# Altium schematic sheet Sheet1.SchDoc
size A4; SheetNumber: 1; SheetTotal: 1
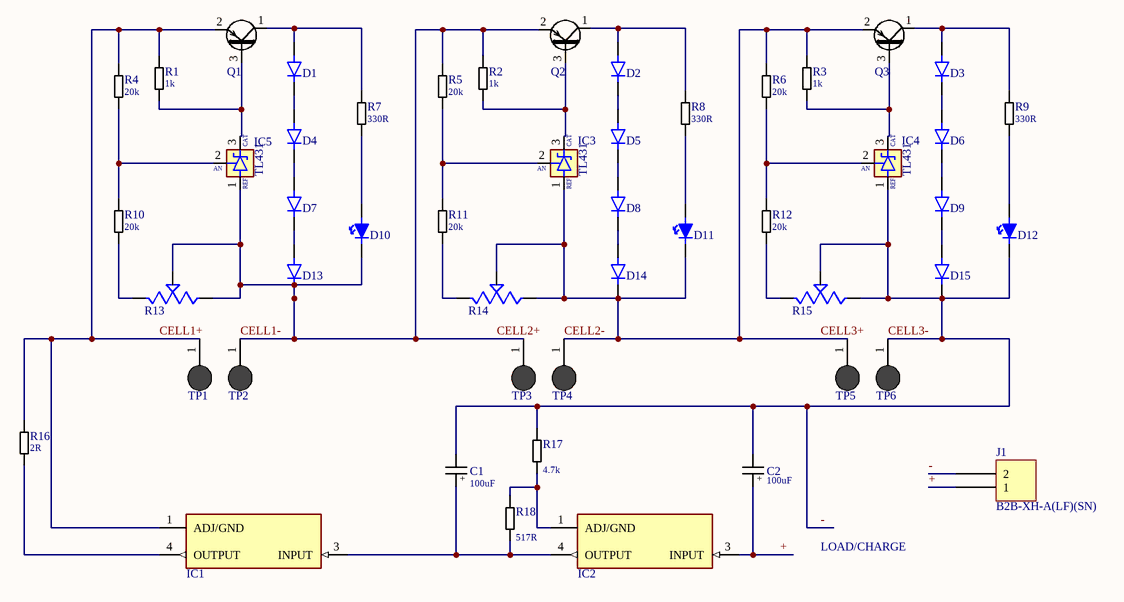
[diagram p0: Sheet1.SchDoc]

## Parts
C1  Capacitance: 100uF  [AL_ELEC_CAP_RAD]  (hidden comment: 493-15610-ND)
C2  Capacitance: 100uF  [AL_ELEC_CAP_RAD]  (hidden comment: 493-15610-ND)
D1  1N4007 SMD  [DO-214AC]  (value not drawn)
D2  1N4007 SMD  [DO-214AC]  (value not drawn)
D3  1N4007 SMD  [DO-214AC]  (value not drawn)
D4  1N4007 SMD  [DO-214AC]  (value not drawn)
D5  1N4007 SMD  [DO-214AC]  (value not drawn)
D6  1N4007 SMD  [DO-214AC]  (value not drawn)
D7  1N4007 SMD  [DO-214AC]  (value not drawn)
D8  1N4007 SMD  [DO-214AC]  (value not drawn)
D9  1N4007 SMD  [DO-214AC]  (value not drawn)
D10  LED TH  [TH_LED]  (value not drawn)
D11  LED TH  [TH_LED]  (value not drawn)
D12  LED TH  [TH_LED]  (value not drawn)
D13  1N4007 SMD  [DO-214AC]  (value not drawn)
D14  1N4007 SMD  [DO-214AC]  (value not drawn)
D15  1N4007 SMD  [DO-214AC]  (value not drawn)
IC1  497-1574-2-ND  [TO-252-3]  (value not drawn)
IC2  497-1574-2-ND  [TO-252-3]  (value not drawn)
IC3  TL431  [TO92-3]
IC4  TL431  [TO92-3]
IC5  TL431  [TO92-3]
J1  B2B-XH-A(LF)(SN)  [JST XH B2B-XH-A]
Q1  BD140  [TO126 (SOT32)]  (value not drawn)
Q2  BD140  [TO126 (SOT32)]  (value not drawn)
Q3  BD140  [TO126 (SOT32)]  (value not drawn)
R1  Resistance: 1k  [TH_RES]  (hidden comment: RES 1K OHM TH)
R2  Resistance: 1k  [TH_RES]  (hidden comment: RES 1K OHM TH)
R3  Resistance: 1k  [TH_RES]  (hidden comment: RES 1K OHM TH)
R4  Resistance: 20k  [TH_RES]  (hidden comment: RES 20K OHM TH)
R5  Resistance: 20k  [TH_RES]  (hidden comment: RES 20K OHM TH)
R6  Resistance: 20k  [TH_RES]  (hidden comment: RES 20K OHM TH)
R7  Resistance: 330R  [TH_RES]  (hidden comment: RES 330R OHM TH)
R8  Resistance: 330R  [TH_RES]  (hidden comment: RES 330R OHM TH)
R9  Resistance: 330R  [TH_RES]  (hidden comment: RES 330R OHM TH)
R10  Resistance: 20k  [TH_RES]  (hidden comment: RES 20K OHM TH)
R11  Resistance: 20k  [TH_RES]  (hidden comment: RES 20K OHM TH)
R12  Resistance: 20k  [TH_RES]  (hidden comment: RES 20K OHM TH)
R13  TRIMPOT  [Trimpot_tube]  (value not drawn)
R14  TRIMPOT  [Trimpot_tube]  (value not drawn)
R15  TRIMPOT  [Trimpot_tube]  (value not drawn)
R16  Resistance: 2R  [TH_RES]  (hidden comment: RES 2R OHM TH)
R17  Resistance: 4.7k  [TH_RES]  (hidden comment: RES 4.7K OHM TH)
R18  Resistance: 517R  [TH_RES]  (hidden comment: RES 517R OHM TH)
TP1  TEST PAD  [TEST_PAD]  (value not drawn)
TP2  TEST PAD  [TEST_PAD]  (value not drawn)
TP3  TEST PAD  [TEST_PAD]  (value not drawn)
TP4  TEST PAD  [TEST_PAD]  (value not drawn)
TP5  TEST PAD  [TEST_PAD]  (value not drawn)
TP6  TEST PAD  [TEST_PAD]  (value not drawn)

## Nets
+: C2.1 IC2.3(INPUT) J1.1
-: C1.2 C2.2 D12.1 D15.C(K) IC4.1(REF) J1.2 R15.1(CCW) R15.2(WIPER) R17.2 TP6.1  [also labelled CELL3-]
CELL1+: IC1.1(ADJ/GND) Q1.2(C) R1.2 R4.2 R16.2 TP1.1
CELL1-: D10.1 D13.C(K) IC5.1(REF) Q2.2(C) R2.2 R5.2 R13.1(CCW) R13.2(WIPER) TP2.1 TP3.1  [also labelled CELL2+]
CELL2-: D11.1 D14.C(K) IC3.1(REF) Q3.2(C) R3.2 R6.2 R14.1(CCW) R14.2(WIPER) TP4.1 TP5.1  [also labelled CELL3+]
NetC1_1: C1.1 IC1.3(INPUT) IC2.4(OUTPUT) R18.1
NetD1_A: D1.A Q1.1(E) R7.2
NetD1_C: D1.C(K) D4.A
NetD2_A: D2.A Q2.1(E) R8.2
NetD2_C: D2.C(K) D5.A
NetD3_A: D3.A Q3.1(E) R9.2
NetD3_C: D3.C(K) D6.A
NetD4_C: D4.C(K) D7.A
NetD5_C: D5.C(K) D8.A
NetD6_C: D6.C(K) D9.A
NetD7_C: D7.C(K) D13.A
NetD8_C: D8.C(K) D14.A
NetD9_C: D9.C(K) D15.A
NetD10_2: D10.2 R7.1
NetD11_2: D11.2 R8.1
NetD12_2: D12.2 R9.1
NetIC1_4: IC1.4(OUTPUT) R16.1
NetIC2_1: IC2.1(ADJ/GND) R17.1 R18.2
NetIC3_2: IC3.2(ANODE) R5.1 R11.2
NetIC3_3: IC3.3(CATHODE) Q2.3(B) R2.1
NetIC4_2: IC4.2(ANODE) R6.1 R12.2
NetIC4_3: IC4.3(CATHODE) Q3.3(B) R3.1
NetIC5_2: IC5.2(ANODE) R4.1 R10.2
NetIC5_3: IC5.3(CATHODE) Q1.3(B) R1.1
NetR10_1: R10.1 R13.3(CW)
NetR11_1: R11.1 R14.3(CW)
NetR12_1: R12.1 R15.3(CW)

## Notes on the sheet
- LOAD/CHARGE
- (in symbol CAP 100uF Radial TH) +
- (in symbol TL431) CAT; AN

## Library data of the parts
C1 C2 = CAP 100uF Radial TH: Cap Aluminum Lytic 100uF 16V 20% (6.3 X 11mm) Radial 2.5mm 175mA 2000h 105 Bulk; Manufacturer: Nichicon; Manufacturer Part Number: UPJ1C101MED; Impedance: 550mR; Leakage Current: 48uA; Life (Hours): 2000Hour; Dissipation Factor: 0.16%; Lead/Base Style: Straight; Lead Diameter: 0.5mm; Designed by: Semih AŞÇI; Supplier 1: Digi-Key; RoHS: Yes; Category: Aluminum Electrolytic Capacitors; Stock 1: 86; Pricing 1: 1=0,40000, 10=0,27700, 50=0,19360, 100=0,16590, 500=0,12446, 1000=0,10510, 2500=0,09957, 5000=0,09404 (USD); Mount: Through Hole; Case/Package: Radial; Min Operating Temperature: -55°C; Max Operating Temperature: 105°C; Package Quantity: 200; Voltage Rating: 16V; Voltage Rating (DC): 16V; Tolerance: 20%; Ripple Current: 175mA; Packaging: Bulk; Termination: Radial; Series: PJ; Construction: RADIAL; Diameter: 6.3mm; Length: 16mm; Height: 11mm; Lead Pitch: 2.5mm; Height - Seated (Max): 0.472inch; Radiation Hardening: No; Lead Free: Lead Free; RoHS Compliant: Yes; ComponentLink1URL: https://datasheet.ciiva.com/30527/getdatasheetpartid-513226-30527124.pdf?src-supplier=Verical; ComponentLink1Description: https://datasheet.ciiva.com/30527/getdatasheetpartid-513226-30527124.pdf?src-supplier=Verical; ComponentLink2URL: https://datasheet.ciiva.com/109/e-pj-109367.pdf?src-supplier=Digi-Key; ComponentLink2Description: https://datasheet.ciiva.com/109/e-pj-109367.pdf?src-supplier=Digi-Key; ComponentLink3URL: https://datasheet.ciiva.com/11686/e-pj-11686584.pdf?src-supplier=Avnet; ComponentLink3Description: https://datasheet.ciiva.com/11686/e-pj-11686584.pdf?src-supplier=Avnet; ComponentLink4URL: https://datasheet.ciiva.com/16389/e-pj-16389048.pdf?src-supplier=Future+Electronics; ComponentLink4Description: https://datasheet.ciiva.com/16389/e-pj-16389048.pdf?src-supplier=Future+Electronics; Supplier Part Number 1: 493-15610-ND
D1-D9 D13-D15 = 1N4007 SMD: VR=1000V IF=1A 15pF; Manufacturer: ON Semiconductor / Fairchild; Max Surge Current: 30A; Max Reverse Current: 5uA; Forward Voltage: 1.1V; Average Rectified Current: 1A; Max Repetitive Reverse Voltage (Vrrm): 1kV; Element Configuration: Single; Polarity: Standard; Power Dissipation: 3W; Supplier 1: Farnell; Manufacturer Part Number: 1N4007; RoHS: Yes; Category: Rectifier Diodes; Pricing 1: 1=0,17200, 10=0,16000, 100=0,05560, 500=0,04900, 1000=0,03000, 2500=0,01440 (EUR); Case/Package: DO-214AC; Number of Pins: 2; Weight: 0.245g; Contact Plating: Tin,Matte; Min Operating Temperature: -65°C; Max Operating Temperature: 175°C; Packaging: Tape and Reel; Peak Non-Repetitive Surge Current: 30A; Package Quantity: 1000; Max Reverse Voltage (DC): 1kV; Max Forward Surge Current (Ifsm): 30A; Forward Current: 1A; Voltage Rating (DC): 1kV; Current Rating: 1A; Output Current: 1A; Reverse Voltage: 1kV; Series: -; Capacitance: 15pF; Diameter: 2.72mm; Length: 5.2mm; Width: 2.72mm; Height: 5.2mm; Radiation Hardening: No; RoHS Compliant: Yes; Lead Free: Lead Free; Reach SVHC Compliant: No SVHC; ComponentLink1URL: https://datasheet.ciiva.com/1239/1n4005-1239313.pdf?src-supplier=Newark; ComponentLink1Description: https://datasheet.ciiva.com/1239/1n4005-1239313.pdf?src-supplier=Newark; ComponentLink2URL: https://datasheet.ciiva.com/927/1n4001-d-927427.pdf?src-supplier=Digi-Key; ComponentLink2Description: https://datasheet.ciiva.com/927/1n4001-d-927427.pdf?src-supplier=Digi-Key; ComponentLink3URL: https://datasheet.ciiva.com/910/1n4001-910362.pdf?src-supplier=Digi-Key; ComponentLink3Description: https://datasheet.ciiva.com/910/1n4001-910362.pdf?src-supplier=Digi-Key; ComponentLink4URL: https://datasheet.ciiva.com/910/1n4001-910361.pdf?src-supplier=Digi-Key; ComponentLink4Description: https://datasheet.ciiva.com/910/1n4001-910361.pdf?src-supplier=Digi-Key; Supplier Part Number 1: 1467514
D10-D12 = LED TH: Radial red led; Designed by: Semih AŞÇI
IC1 IC2 = LM317: Reg Standard Lin Adj Pos 1.2V to 37V 0.2A 3-Pin (2+Tab) DPAK T/R; Manufacturer: STMicroelectronics; Manufacturer Part Number: LM317MDT-TR; Number of Outputs: 1; Output Current: 500mA; Max Input Voltage: 40V; Min Input Voltage: 4.2V; Max Output Current: 200mA; Polarity: Positive; Reference Voltage: 1.3V; Power Supply Rejection Ratio (PSRR): 80dB; Output Type: Adjustable; Supplier 1: Farnell; RoHS: Yes; Category: Voltage Regulators - Linear; Stock 1: 21391; Pricing 1: 5=1,24000, 10=1,05000, 100=0,80700, 500=0,71400 (EUR); Mount: Surface Mount; Case/Package: TO-252; Number of Pins: 3; Weight: 0.063493oz; Contact Plating: Tin,Matte; Min Operating Temperature: 0°C; Max Operating Temperature: 125°C; Packaging: Tape and Reel; Output Voltage: 37V; Package Quantity: 1; Number of Regulators: 1; Min Output Voltage: 1.2V; Max Output Voltage: 37V; Series: LM317; Length: 6.6mm; Width: 6.2mm; Height: 2.4mm; Radiation Hardening: No; Reach SVHC Compliant: No SVHC; Lead Free: Lead Free; ComponentLink1URL: https://datasheet.ciiva.com/41440/001185006-da-01-en-ic-reg-ldo-adj-lm317mdt-tr-to-252-3-stm-41440182.pdf?src-supplier=Conrad; ComponentLink1Description: https://datasheet.ciiva.com/41440/001185006-da-01-en-ic-reg-ldo-adj-lm317mdt-tr-to-252-3-stm-41440182.pdf?src-supplier=Conrad; Supplier Part Number 1: 2296022
J1 = B2B-XH-A(LF)(SN): CONN HEADER VERT 2POS 2.5MM; Manufacturer: JST Sales America Inc.; Contact Length - Post: 0.134" (3.40mm); Current Rating (Amps): 3A; Material Flammability Rating: UL94 V-0; Number of Positions: 2; Number of Positions Loaded: All; Pitch - Mating: 0.098" (2.50mm); Shrouding: Shrouded - 4 Wall; Style: Board to Cable/Wire; Voltage Rating: 250V; Part Number: B2B-XH-A(LF)(SN); ComponentLink1Description: Datasheet; ComponentLink1URL: http://www.jst-mfg.com/product/pdf/eng/eXH.pdf; ComponentLink2Description: DigiKey Link; ComponentLink2URL: http://digikey.com/product-detail/en/jst-sales-america-inc/B2B-XH-A-LF-SN/455-2247-ND/1651045; Connector Type: Header; Contact Finish - Mating: Tin; Contact Finish - Post: Tin; Contact Material: Brass; Contact Shape: Square; Contact Type: Male Pin; Fastening Type: Detent Lock; Insulation Color: Natural; Insulation Height: 0.276" (7.00mm); Insulation Material: Polyamide (PA66), Nylon 6/6; LastUpdated: 12.01.2020 23:46:08; Lifecycle Status: Active; Minimum Order: 1; Mounting Type: Through Hole; Number of Rows: 1; Operating Temperature: -25°C ~ 85°C; Packaging: Bulk; PartId: 67; Part Status: Active; Price: 0.15; Series: XH; Supplier 1: DigiKey; Supplier Part Number 1: 455-2247-ND; Termination: Press-Fit, Solder
Q1-Q3 = BD140: Trans GP BJT PNP 80V 1.5A 1250mW 3-Pin(3+Tab) SOT-32 Tube / TRANS PNP 80V 1.5A SOT-32; Manufacturer: ON Semiconductor / Fairchild; Max Power Dissipation: 1.25W; Collector Emitter Voltage (VCEO): 500mV; Element Configuration: Single; Collector Base Voltage (VCBO): -80V; Emitter Base Voltage (VEBO): -5V; hFE Min: 25; Max Breakdown Voltage: 100V; Designed by: Semih AŞÇI; Supplier 1: Digi-Key; Manufacturer Part Number: BD140; RoHS: No; Category: BJTs; Mount: Through Hole; Case/Package: TO-126-3; Number of Pins: 3; Min Operating Temperature: -55°C; Max Operating Temperature: 150°C; Package Quantity: 500; Packaging: Bulk; Polarity: PNP; Collector Emitter Breakdown Voltage: 80V; Max Collector Current: 1.5A; Collector Emitter Saturation Voltage: 500mV; RoHS Compliant: No; ComponentLink1URL: https://datasheet.ciiva.com/985/bd136-d-985528.pdf?src-supplier=Digi-Key; ComponentLink1Description: https://datasheet.ciiva.com/985/bd136-d-985528.pdf?src-supplier=Digi-Key; Supplier Part Number 1: BD140OS-ND
R1-R3 = RES 1K OHM TH: Designed by: Semih AŞÇI
R4-R6 R10-R12 = RES 20K OHM TH: Res 20K Ohm  TH; Designed by: Semih AŞÇI
R7-R9 = RES 330R OHM TH: Res 330R Ohm  TH; Designed by: Semih AŞÇI
R13-R15 = TRIMPOT: 20k trimpot; Designed by: Semih AŞÇI
R16 = RES 2R OHM TH: Res 2R Ohm 1W TH; Designed by: Semih AŞÇI
R17 = RES 4.7K OHM TH: Res 4.7K Ohm  TH; Designed by: Semih AŞÇI
R18 = RES 517R OHM TH: Res 517R Ohm  TH; Designed by: Semih AŞÇI